# EAGLE design Si4825_KIT_TH (EAGLE 7.5.0)
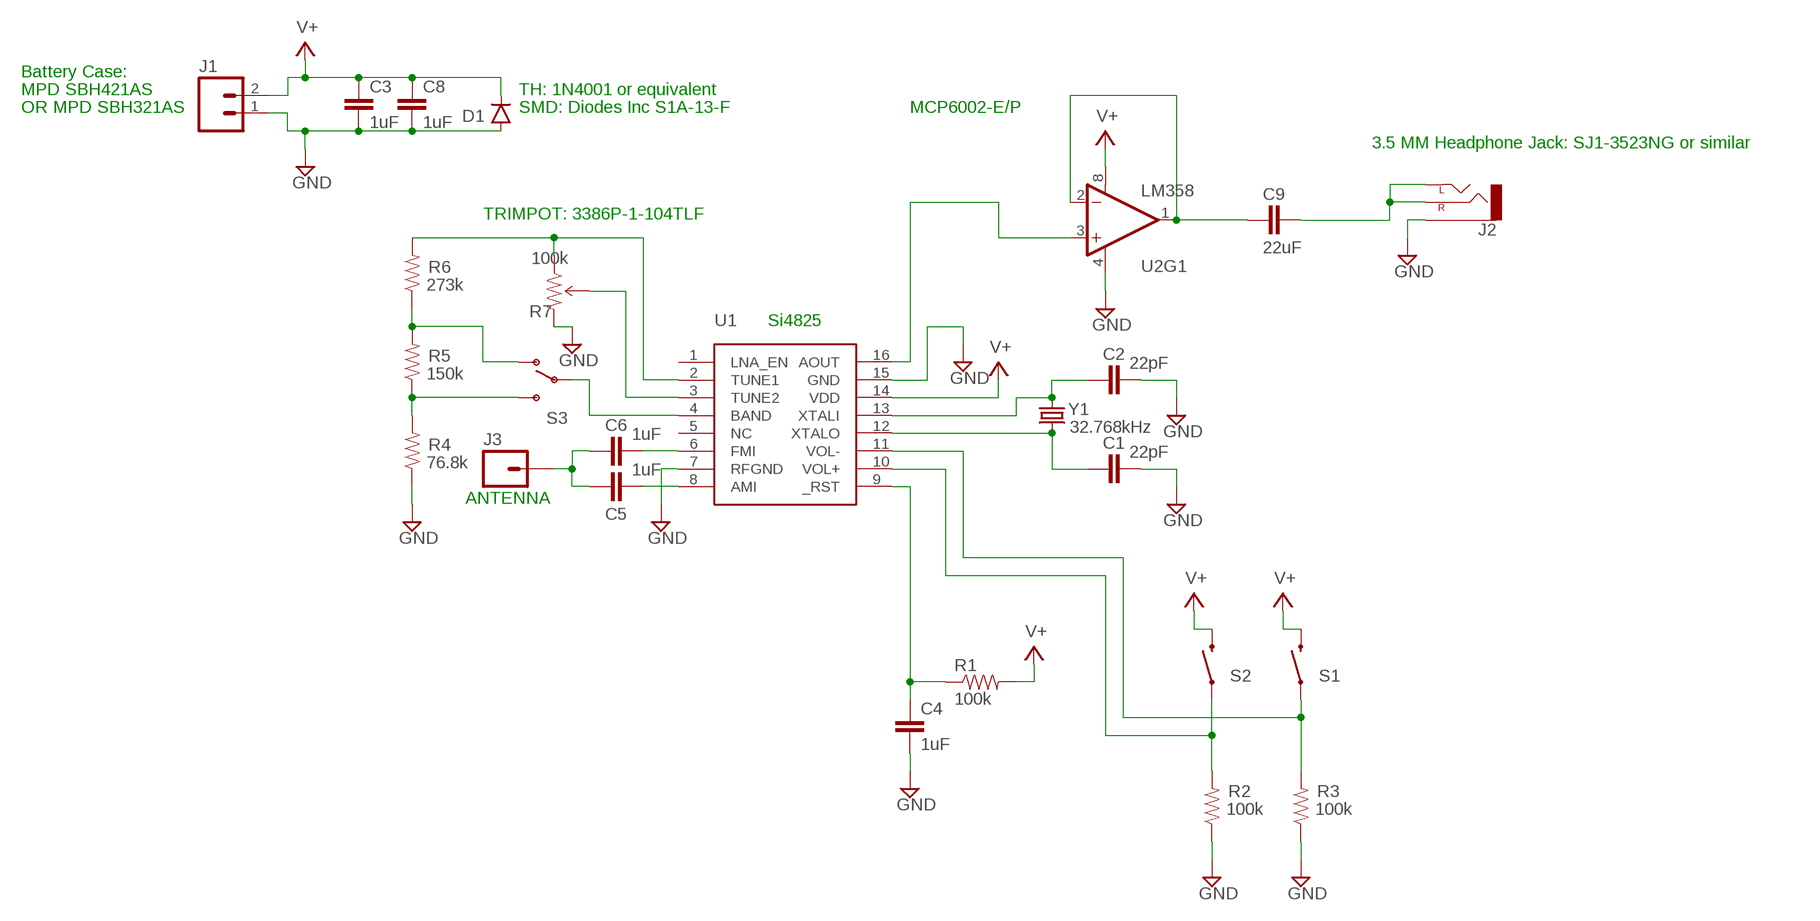
[diagram p0: schematic, sheet 1]

## Parts
C1  22pF  CAPPTH2  [CAP-PTH-SMALL2]
C2  22pF  CAPPTH2  [CAP-PTH-SMALL2]
C3  1uF  CAP_  [AXIAL-5MM]
C4  1uF  CAP_  [AXIAL-5MM]
C5  1uF  CAP_  [AXIAL-5MM]
C6  1uF  CAP_  [AXIAL-5MM]
C8  1uF  CAP_  [AXIAL-5MM]
C9  22uF  CAP_  [AXIAL-5MM]
D1  DIODEPTH  [DIODE-1N4001]
J1  M02PTH  [1X02]
J2  AUDIO-JACKPTH  [AUDIO-JACK]
J3  M01PTH  [1X01]
R1  100k  RESISTORAXIAL-0.3  [AXIAL-0.3]
R2  100k  RESISTORAXIAL-0.3  [AXIAL-0.3]
R3  100k  RESISTORAXIAL-0.3  [AXIAL-0.3]
R4  76.8k  RESISTORAXIAL-0.3  [AXIAL-0.3]
R5  150k  RESISTORAXIAL-0.3  [AXIAL-0.3]
R6  273k  RESISTORAXIAL-0.3  [AXIAL-0.3]
R7  100k  BOURNS_3386P  [BOURNS_3386P]
S1  SWITCH-MOMENTARY-2PTH  [TACTILE-PTH]
S2  SWITCH-MOMENTARY-2PTH  [TACTILE-PTH]
S3  SWITCH-SPDTPTH  [SWITCH-SPDT]
U1  SI4825  [SO16]
U2  LM358  [DIP08]
Y1  32.768kHz  CRYSTALTC26H  [TC26H]

## Nets
GND: C1.2 C2.2 C3.P$2 C4.P$2 C8.P$2 D1.A J1.1 J2.SLEEVE R2.P$1 R3.P$1 R4.P$1 R7.P$3(CW) U1.7(RFGND) U1.15(GND) U2.4(V-)
N$1: C5.P$2 U1.8(AMI)
N$2: C1.1 U1.12(XTALO) Y1.2
N$3: C2.1 U1.13(XTALI) Y1.1
N$4: C4.P$1 R1.P$1 U1.9(_RST)
N$5: R2.P$2 S2.1 U1.10(VOL+)
N$6: R3.P$2 S1.1 U1.11(VOL-)
N$7: S3.2(P) U1.4(BAND)
N$8: R4.P$2 R5.P$1 S3.3(S)
N$9: R5.P$2 R6.P$1 S3.1(O)
N$10: R6.P$2 R7.P$1(CCW) U1.2(TUNE1)
N$11: C6.P$2 U1.6(FMI)
N$12: R7.P$2(WIPER) U1.3(TUNE2)
N$13: C9.P$1 U2.1(OUT) U2.2(-IN)
N$14: U1.16(AOUT) U2.3(+IN)
N$15: C5.P$1 C6.P$1 J3.1
N$18: C9.P$2 J2.RING(RIGHT) J2.TIP(LEFT)
V+: C3.P$1 C8.P$1 D1.C J1.2 R1.P$2 S1.3 S2.3 U1.14(VDD)
Unconnected: U1.1(LNA_EN) U1.5(NC) U2.5(+IN) U2.6(-IN) U2.7(OUT)

## Notes on the sheet
- Battery Case:
- MPD SBH421AS | TH: 1N4001 or equivalent
- OR MPD SBH321AS | SMD: Diodes Inc S1A-13-F | MCP6002-E/P
- 3.5 MM Headphone Jack: SJ1-3523NG or similar
- TRIMPOT: 3386P-1-104TLF
- Si4825
- ANTENNA

## Power pins joined to a net without a drawn wire
V+: U2.8(V+)

## Library data of the parts
C1-C6 C8 C9 = SparkFun-Capacitors:CAP: Capacitor Standard 0603 ceramic capacitor, and 0.1" leaded capacitor.
D1 = SparkFun-DiscreteSemi:DIODE: Diode These are standard reverse protection diodes and small signal diodes. SMA package can handle up to about 1A. SOD-323 can handle about 200mA. What the SOD-323 package when ordering, there are some mfgs out there that are 5-pin packages.
J1 = SparkFun-Connectors:M02: Standard 2-pin 0.1" header. Use with - straight break away headers ( PRT-00116) - right angle break away headers (PRT-00553) - swiss pins (PRT-00743) - machine pins (PRT-00117) - female headers (PRT-00115) Molex polarized connector foot print use with: PRT-08233 with associated crimp pins and housings. 2.54_SCREWTERM for use with PRT-10571. 3.5mm Screw Terminal footprints for PRT-08084 5mm Screw Terminal footprints for use with PRT-08432
J2 = SparkFun-Connectors:AUDIO-JACK: 3.5mm Audio Jack Simple 3.5mm common PCB mount audio jack. Variant PTH is our storefront SKU PRT-08032
J3 = SparkFun-Connectors:M01: Header 1 Standard 1-pin 0.1" header. Use with straight break away headers (SKU : PRT-00116), right angle break away headers (PRT-00553), swiss pins (PRT-00743), machine pins (PRT-00117), and female headers (PRT-00115). SMTSO-256-ET is a "flush mount" nut for a 4-40 screw. The older package used to be too tight, and did not allow it to sit properly thru the drill hit. The latest (0.165DIA) fits nice and snug.
R1-R6 = SparkFun-Resistors:RESISTOR: Resistor Basic schematic elements and footprints for 0603, 1206, and PTH resistors.
R7 = Si4825:BOURNS_3386P
S1 S2 = SparkFun-Electromechanical:SWITCH-MOMENTARY-2: Various NO switches- pushbuttons, reed, etc; PROD_ID: SWCH-08441
S3 = SparkFun-Electromechanical:SWITCH-SPDT: SPDT Switch Simple slide switch, Spark Fun Electronics SKU : COM-00102 DPDT SMT slide switch, AYZ0202, SWCH-08179; PROD_ID: SWCH-08261
U1 = Si4825:SI4825
U2 = SparkFun-AnalogIC:LM358: Jellybean op-amp; PROD_ID: IC-09172
Y1 = SparkFun-FreqCtrl:CRYSTAL: Various standard crystals. Proven footprints.; PROD_ID: XTAL-10112

## Board
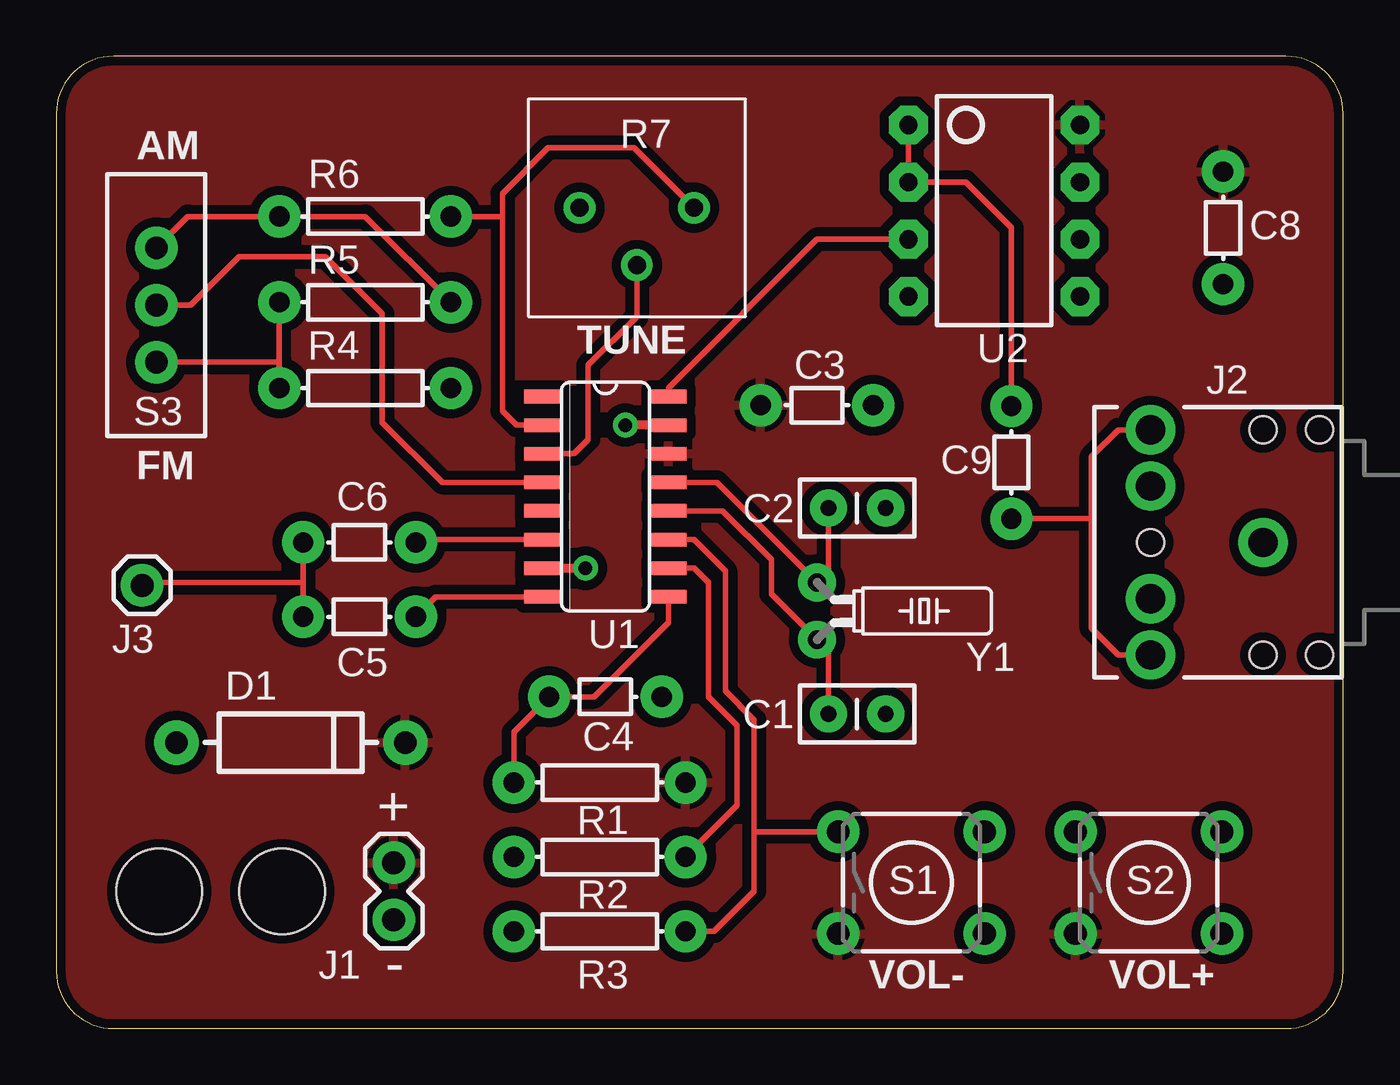
[diagram p1: board, top side]
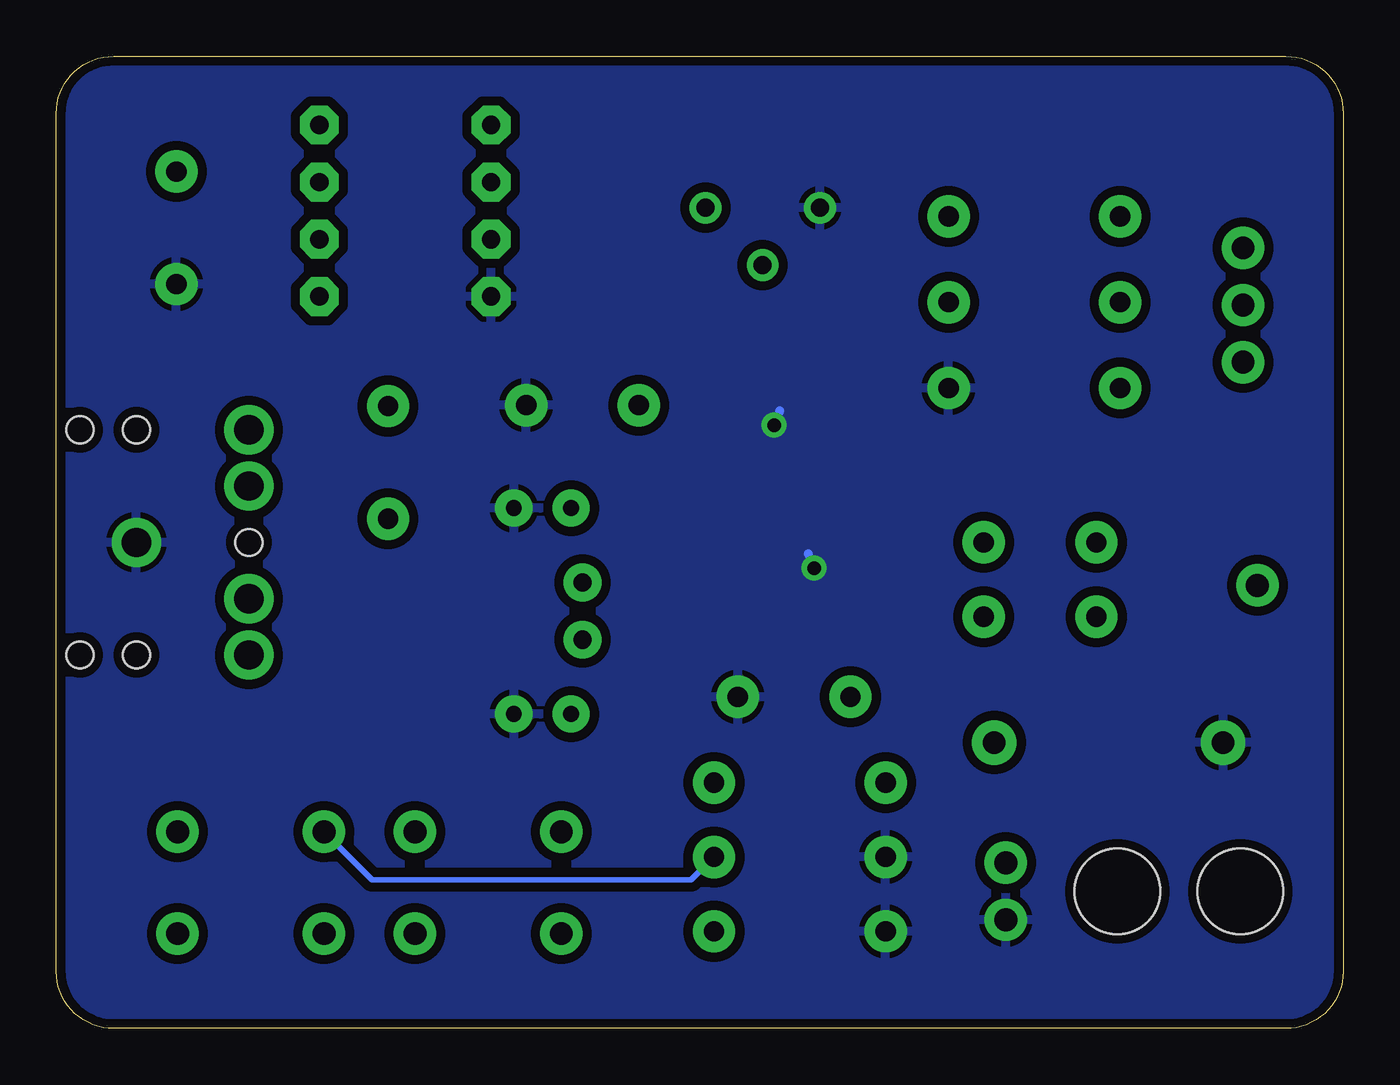
[diagram p2: board, bottom side, seen from below]

Size 57.15 x 43.18 mm. Coordinates in mm from the lower left corner, seen from the top.
Outline: 54.61,43.18 2.54,43.18 arc90 0,40.64 0,2.54 arc90 2.54,0 54.61,0 arc90 57.15,2.54 57.15,40.64 arc90 54.61,43.18
Copper layers (1*16): Top 0.035mm / dielectric 1.5mm / Bottom 0.035mm
Design rules "SparkFun": minimum track width 8mil, minimum drill 20mil, track to track 8mil, track to pad 8mil, pad to pad 8mil, via to via 8mil, smd to smd 8mil, copper to edge 10mil, drill to drill 8mil, minimum pad ring 12mil, minimum via ring 10mil, stop-mask expansion 4mil, vias tented up to drill 25mil, thermal gap 10mil
Holes 3.81 mm at 10.03,6.1 4.57,6.1

### Footprints (pad centres in the part's own frame; a part is rotated, then mirrored left to right if it is on the bottom)
CAP-PTH-SMALL2 = drill 0.7 pad 1.651: 1 0,0; 2 2.54,0
AXIAL-5MM = drill 0.9 pad 1.88: P$1 -2.5,0; P$2 2.5,0
DIODE-1N4001 = drill 1 pad 1.981: A -5.08,0; C 5.08,0
1X02 = drill 1.016 pad 1.88: 1 0,0; 2 2.54,0
AUDIO-JACK = drill 1.3 pad 2.184: RING 5,5; RSH 5,2.5; SLEEVE 0,0; TIP 5,-5; TSH 5,-2.5 | hole 1.2: 0,5; -2.5,5; -2.5,-5; 0,-5; 5,0
1X01 = drill 1.016 pad 1.88: 1 0,0
AXIAL-0.3 = drill 0.9 pad 1.88: P$1 -3.81,0; P$2 3.81,0
BOURNS_3386P = drill 0.8: P$1 2.54,0; P$2 0,-2.54; P$3 -2.54,0
TACTILE-PTH = drill 1.016 pad 1.88: 1 -3.251,2.261; 2 3.251,2.261; 3 -3.251,-2.261; 4 3.251,-2.261
SWITCH-SPDT = drill 1.016 pad 1.88: 1 0,2.54; 2 0,0; 3 0,-2.54
SO16 = smd 0.6 x 1.6: 1 -4.445,-2.8; 2 -3.175,-2.8; 3 -1.905,-2.8; 4 -0.635,-2.8; 5 0.635,-2.8; 6 1.905,-2.8; 7 3.175,-2.8; 8 4.445,-2.8; 9 4.445,2.8; 10 3.175,2.8; 11 1.905,2.8; 12 0.635,2.8; 13 -0.635,2.8; 14 -1.905,2.8; 15 -3.175,2.8; 16 -4.445,2.8
DIP08 = drill 0.813 pad 1.727 octagon: 1 -3.81,-3.81; 2 -1.27,-3.81; 3 1.27,-3.81; 4 3.81,-3.81; 5 3.81,3.81; 6 1.27,3.81; 7 -1.27,3.81; 8 -3.81,3.81
TC26H = drill 0.813 pad 1.676: 1 -1.27,0; 2 1.27,0

### Placement (x,y rotation side)
C1  34.29,13.97 0 top
C2  34.29,23.11 0 top
C3  33.78,27.69 0 top
C4  24.38,14.73 0 top
C5  13.46,18.29 0 top
C6  13.46,21.59 0 top
C8  51.82,35.56 270 top
C9  42.42,25.15 270 top
D1  10.41,12.7 0 top
J1  14.99,4.83 90 top
J2  53.59,21.59 180 top
J3  3.81,19.68 0 top
R1  24.13,10.92 0 top
R2  24.13,7.62 0 top
R3  24.13,4.32 0 top
R4  13.72,28.45 180 top
R5  13.72,32.26 0 top
R6  13.72,36.07 0 top
R7  25.78,36.45 0 top
S1  37.97,6.48 0 top
S2  48.51,6.48 0 top
S3  4.45,32.13 0 top
U1  24.38,23.62 270 top
U2  41.66,36.32 270 top
Y1  33.78,18.54 270 top

### Tracks (layer width: path | path; a pad name or v marks a point on that pad's centre or on a via)
GND  (via drill 0.6)
  Top 0.406: U1.7 v23.5,20.45 | U1.15 v25.27,26.8
  Bottom 0.406: v23.5,20.45 23.75,21.08 | v25.27,26.8 25.02,27.43
  pour Bottom (isolate 0.406): 0,0 57.15,0 57.15,43.18 0,43.18
N$1
  Top 0.254: U1.8 16.85,19.18 C5.P$2
N$2
  Top 0.254: U1.12 29.59,22.99 31.75,20.83 31.75,19.3 Y1.2 34.29,16.76 C1.1
N$3
  Top 0.254: U1.13 29.34,24.26 Y1.1 34.29,20.32 C2.1
N$4
  Top 0.254: R1.P$1 20.32,13.17 C4.P$1 23.88,14.73 27.18,18.03 U1.9
N$5
  Top 0.254: U1.10 28.32,20.45 28.96,19.81 28.96,14.73 30.23,13.46 30.23,9.91 R2.P$2
  Bottom 0.254: R2.P$2 28.96,6.6 43.13,6.6 S2.1
N$6
  Top 0.254: 27.94,4.5 R3.P$2 29.21,4.32 30.99,6.1 30.99,8.74 | U1.11 28.32,21.72 29.72,20.32 29.72,14.99 30.99,13.72 30.99,8.74 | S1.1 30.99,8.74
N$7
  Top 0.254: S3.2 5.97,32.13 8.13,34.29 11.94,34.29 14.48,31.75 14.48,26.92 17.14,24.26 U1.4
N$8
  Top 0.254: R4.P$2 9.91,29.59 | R5.P$1 9.91,29.72 9.91,29.59 | S3.3 9.91,29.59
N$9
  Top 0.254: S3.1 5.84,36.07 R6.P$1 13.72,36.07 R5.P$2
N$10
  Top 0.254: R6.P$2 19.81,36.07 | 19.81,36.07 19.81,37.08 21.84,39.12 25.65,39.12 R7.P$1 | 19.81,36.07 19.81,27.43 20.45,26.8 U1.2
N$11
  Top 0.254: U1.6 16.09,21.72 C6.P$2
N$12
  Top 0.254: R7.P$2 25.78,31.62 23.62,29.46 23.62,26.16 22.99,25.53 U1.3
N$13
  Top 0.254: U2.1 U2.2 40.39,37.59 42.42,35.56 C9.P$1
N$14
  Top 0.254: U1.16 27.18,28.45 33.78,35.05 U2.3
N$15
  Top 0.254: C6.P$1 10.96,19.81 | 10.96,19.81 C5.P$1 | J3.1 3.94,19.81 10.96,19.81
N$18
  Top 0.254: 45.97,22.61 45.97,17.78 47.16,16.59 J2.RING | 45.97,22.61 45.97,25.4 47.16,26.59 J2.TIP | C9.P$2 45.93,22.65 45.97,22.61
V+
  pour Top (isolate 0.406): 0,0 57.15,0 57.15,43.18 0,43.18

### Text on the board
tPlace: AM | TUNE | FM | + | - | VOL- | VOL+